# EAGLE schematic Fiação MR21 v3 (EAGLE 9.7.0)
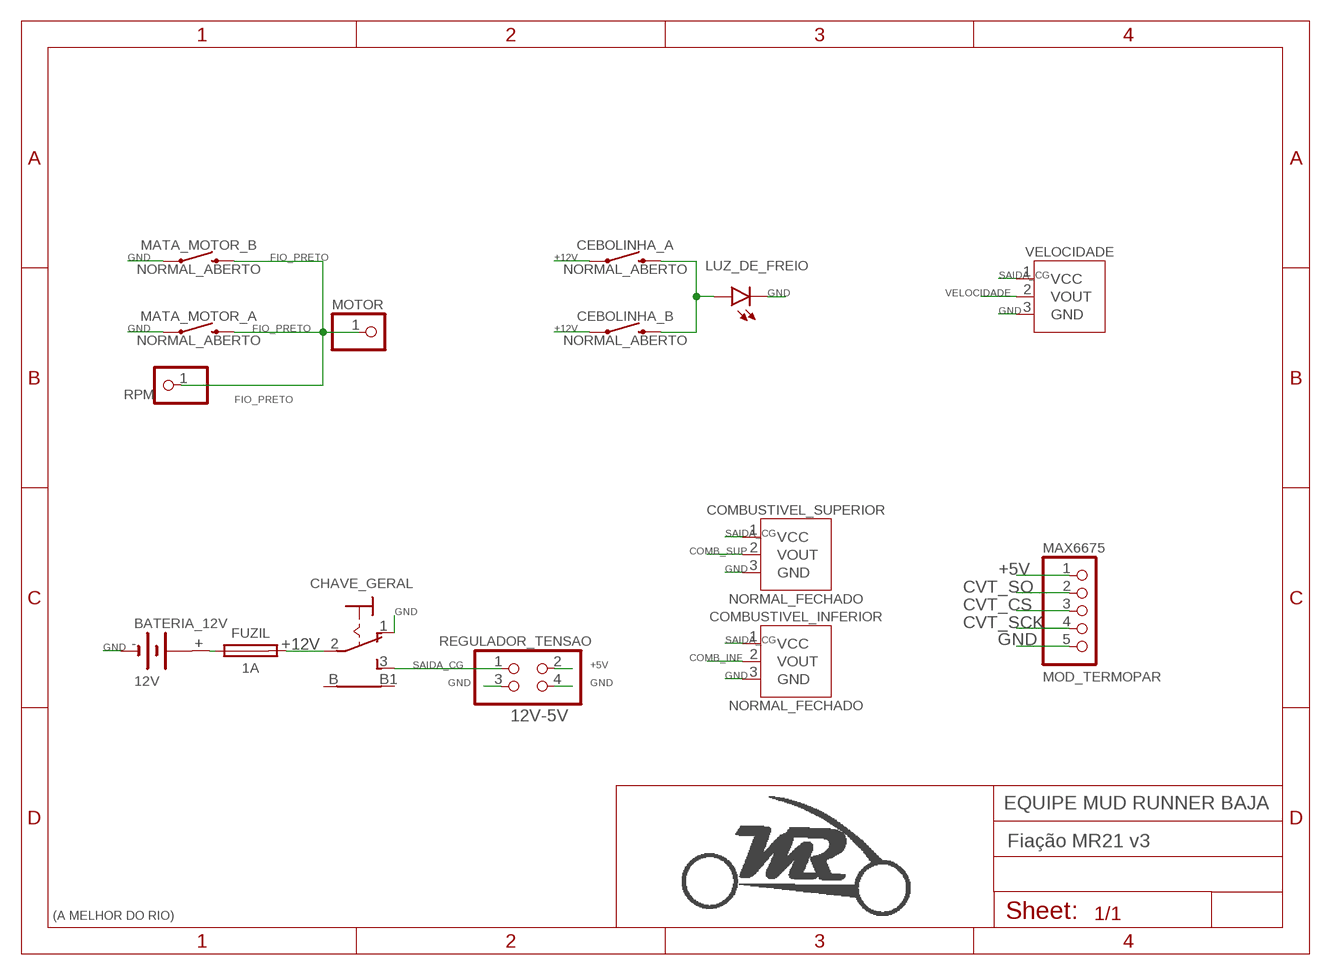
[diagram p0: schematic, sheet 1]

## Parts
BATERIA_12V  12V  2V110R  [2V110R]
CEBOLINHA_A  NORMAL_ABERTO  MOMENTARY-SWITCH-SPST-SMD-12MM  [TACTILE_SWITCH_SMD_12MM]
CEBOLINHA_B  NORMAL_ABERTO  MOMENTARY-SWITCH-SPST-SMD-12MM  [TACTILE_SWITCH_SMD_12MM]
CHAVE_GERAL  316-917  [316-917]
COMBUSTIVEL_INFERIOR  NORMAL_FECHADO  A1324LLHLT-TLH  [SOT95P285X113-3N]
COMBUSTIVEL_SUPERIOR  NORMAL_FECHADO  A1324LLHLT-TLH  [SOT95P285X113-3N]
FUZIL  1A  1812L010  [FUSC4532X125]
LUZ_DE_FREIO  CHIP-ROUND-R_1209  [LEDC3224X250N_RND-R]
MATA_MOTOR_A  NORMAL_ABERTO  MOMENTARY-SWITCH-SPST-SMD-12MM  [TACTILE_SWITCH_SMD_12MM]
MATA_MOTOR_B  NORMAL_ABERTO  MOMENTARY-SWITCH-SPST-SMD-12MM  [TACTILE_SWITCH_SMD_12MM]
MAX6675  MOD_TERMOPAR  PINHD-1X55X2MM  [1_05X2MM]
MOTOR  PINHD-1X1  [1X01]
REGULADOR_TENSAO  12V-5V  PINHD-2X2/90  [2X02/90]
RPM  PINHD-1X1  [1X01]
VELOCIDADE  A1324LLHLT-TLH  [SOT95P285X113-3N]

## Nets
+5V: MAX6675.1 REGULADOR_TENSAO.2
+12V: CEBOLINHA_A.1 CEBOLINHA_B.1 CHAVE_GERAL.2(P) FUZIL.2
COMB_INF: COMBUSTIVEL_INFERIOR.2(VOUT)
COMB_SUP: COMBUSTIVEL_SUPERIOR.2(VOUT)
CVT_CS: MAX6675.3
CVT_SCK: MAX6675.4
CVT_SO: MAX6675.2
FIO_PRETO: MATA_MOTOR_A.3 MATA_MOTOR_B.3 MOTOR.1 RPM.1
GND: BATERIA_12V.- CHAVE_GERAL.1(O) COMBUSTIVEL_INFERIOR.3(GND) COMBUSTIVEL_SUPERIOR.3(GND) LUZ_DE_FREIO.C MATA_MOTOR_A.1 MATA_MOTOR_B.1 MAX6675.5 REGULADOR_TENSAO.3 REGULADOR_TENSAO.4 VELOCIDADE.3(GND)
N$1: CEBOLINHA_A.3 CEBOLINHA_B.3 LUZ_DE_FREIO.A
N$2: BATERIA_12V.+ FUZIL.1
SAIDA_CG: CHAVE_GERAL.3(S) COMBUSTIVEL_INFERIOR.1(VCC) COMBUSTIVEL_SUPERIOR.1(VCC) REGULADOR_TENSAO.1 VELOCIDADE.1(VCC)
VELOCIDADE: VELOCIDADE.2(VOUT)
Unconnected: BATERIA_12V.+@1(+) CHAVE_GERAL.B CHAVE_GERAL.B1

## Notes on the sheet
- EQUIPE MUD RUNNER BAJA
- (A MELHOR DO RIO)

## Library data of the parts
BATERIA_12V = battery:2V110R: NC ACCU Varta
CEBOLINHA_A CEBOLINHA_B MATA_MOTOR_A MATA_MOTOR_B = SparkFun-Switches:MOMENTARY-SWITCH-SPST: Momentary Switch (Pushbutton) - SPST Normally-open (NO) SPST momentary switches (buttons, pushbuttons). Variants PTH-12MM - 12mm square, through-hole Momentary Pushbutton Switch - 12mm Square <https://www.sparkfun.com/products/9190> (COM-09190) PTH-6.0MM, PTH-6.0MM-KIT - 6.0mm square, through-hole Mini Pushbutton Switch <https://www.sparkfun.com/products/97> (COM-00097) KIT package intended for soldering kit's - only one side of pads' copper is exposed. PTH-RIGHT-ANGLE-KIT - Right-angle, through-hole Right Angle Tactile Button <https://www.sparkfun.com/products/10791> - Used on SparkFun BigTime Watch Kit <https://www.sparkfun.com/products/11734> SMD-12MM - 12mm square, surface-mount Tactile Button - SMD (12mm) <https://www.sparkfun.com/products/12993> (COM-12993) Used on SparkFun PicoBoard <https://www.sparkfun.com/products/11888> SMD-4.5MM - 4.5mm Square Trackball Switch Used on SparkFun Blackberry Trackballer Breakout <https://www.sparkfun.com/products/13169> SMD-4.6MMX2.8MM - 4.60mm x 2.80mm, surface mount Used on SparkFun SAMD21 Mini Breakout <https://www.sparkfun.com/products/13664> SMD-5.2MM, SMD-5.2-REDUNDANT - 5.2mm square, surface-mount Mini Pushbutton Switch - SMD <https://www.sparkfun.com/products/8720> (COM-08720) Used on Arduino Pro Mini <https://www.sparkfun.com/products/11114> REDUNDANT package connects both switch circuits together SMD-6.0X3.5MM - 6.0 x 3.5mm, surface mount Momentary Reset Switch SMD <https://www.sparkfun.com/products/8229> (COM-08229) SMD-6.2MM-TALL - 6.2mm square, surface mount Tactile Button - SMD (6mm) <https://www.sparkfun.com/products/12992> Used on SparkFun Digital Sandbox <https://www.sparkfun.com/products/12651> SMD-RIGHT-ANGLE - Right-angle, surface mount Used on SparkFun Block for Intel® Edison - Arduino <https://www.sparkfun.com/products/13036>; PROD_ID: SWCH-11967; SF_SKU: COM-12993
CHAVE_GERAL = switch:316-917: TOGGLE SWITCH Mors, distributor RS Components
COMBUSTIVEL_INFERIOR COMBUSTIVEL_SUPERIOR VELOCIDADE = Sensor:A1324LLHLT-T: SENSOR HALL EFFECT ANALOG SOT23W; CATEGORY: Sensor; MANUFACTURER: Allegro microsystems; MPN: A1324LLHLT-T; OPERATING_TEMP: -40 to 150 °C; PART_STATUS: Active; ROHS_COMPLIANT: RoHS3 Compliant; SUB-CATEGORY: Magnetic; VALUE: A1324LLHLT
FUZIL = Fuse:1812L: 1812L Series PTC provides surface mount overcurrent protection for applications where resettable protection is desired. Datasheet <https://www.littelfuse.com/~/media/electronics/datasheets/resettable_ptcs/littelfuse_ptc_1812l_datasheet.pdf.pdf>; CATEGORY: FUSE; DESCRIPTION: Resettable PTCs; MANUFACTURER: Littlefuse; MPN: 1812L010; OPERATING_TEMPERATURE: -40°C to +85°C; PART_STATUS: ACTIVE; ROHS_COMPLIANCE: RoHS Compliant; SERIES: 1812L; SUBCATEGORY: Resettable; TYPE: PTC
LUZ_DE_FREIO = LED:CHIP-ROUND-R: LED - Generic; CATEGORY: LED; COLOR: RED; DESCRIPTION: CHIP LED ROUND; SUB-CATEGORY: CHIP; TYPE: ROUND_TOP; VALUE: LED_RED
MAX6675 = Connector:PINHD-1X5: PIN HEADER; CATEGORY: CONNECTOR; SUB-CATEGORY: PIN-HEADER
MOTOR RPM = Connector:PINHD-1X1: PIN HEADER; CATEGORY: CONNECTOR; SUB-CATEGORY: PIN-HEADER
REGULADOR_TENSAO = Connector:PINHD-2X2: PIN HEADER; CATEGORY: CONNECTOR; SUB-CATEGORY: PIN-HEADER